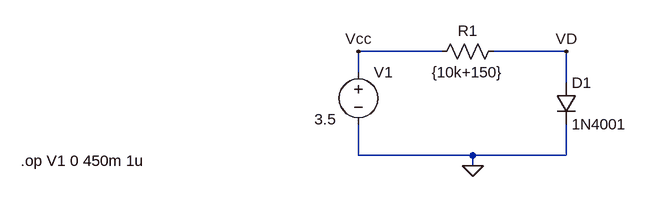
[diagram p0: schematic Diodo Punto Q.asc]
Diodo Punto Q.asc, the LTspice schematic file:
Version 4
SHEET 1 880 680
WIRE 0 64 -128 64
WIRE 192 64 80 64
WIRE -128 96 -128 64
WIRE 192 112 192 64
WIRE -128 224 -128 176
WIRE 48 224 -128 224
WIRE 192 224 192 176
WIRE 192 224 48 224
WIRE 48 240 48 224
FLAG 48 240 0
FLAG 192 64 VD
FLAG -128 64 Vcc
SYMBOL diode 176 112 R0
SYMATTR InstName D1
SYMATTR Value 1N4001
SYMBOL res 96 48 R90
WINDOW 0 0 56 VBottom 2
WINDOW 3 32 56 VTop 2
SYMATTR InstName R1
SYMATTR Value {10k+150}
SYMBOL voltage -128 80 R0
WINDOW 3 -68 88 Left 2
WINDOW 123 0 0 Left 0
WINDOW 39 0 0 Left 0
SYMATTR Value 3.5
SYMATTR InstName V1
TEXT -648 232 Left 2 !.op V1 0 450m 1u

The netlist it stands for:
* Diodo Punto Q.asc
D1 VD 0 1N4001
R1 VD Vcc {10k+150}
V1 Vcc 0 3.5
.model D D
.lib standard.dio
.op V1 0 450m 1u
.backanno
.end

* Results of the author's LTspice run, read from the files saved beside the schematic
* Operating Point:
*   V(vd) = 510.4 mV
*   V(vcc) = 3.5 V
*   I(D1) = 294.5 µA
*   I(R1) = -294.5 µA
*   I(V1) = -294.5 µA